# Altium project ProtoStack_H750VBT.PrjPcb
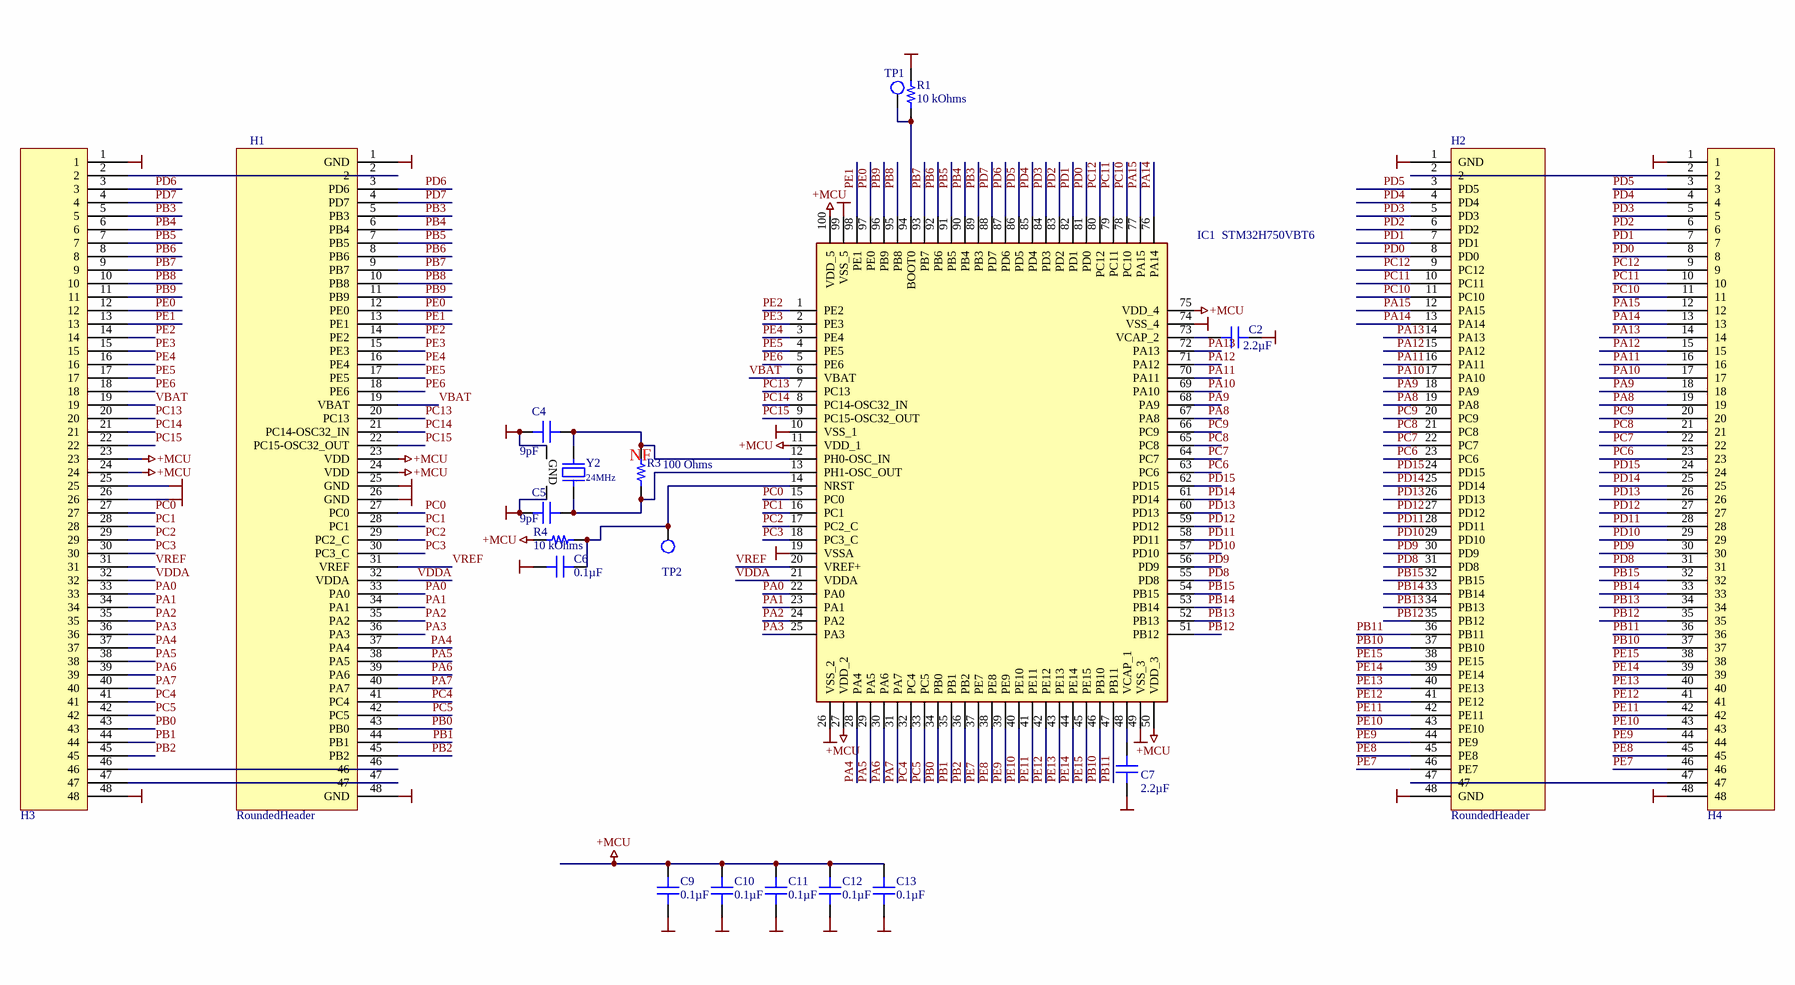
[diagram p0: ProtoStack_H750VBT.SchDoc]
1 sheet, 21 parts. Net scope: global (net labels, ports and power ports of the same name join across sheets).
Board file: ProtoStack_H750VBT.PcbDoc

## Sheet ProtoStack_H750VBT.SchDoc
size A2

### Parts
C2  2.2µF  [CAP 0805_2012]
C4  9pF  [CAP 0805_2012]
C5  9pF  [CAP 0805_2012]
C6  0.1µF  [CAP 0402_1005]
C7  2.2µF  [CAP 0805_2012]
C9  0.1µF  [CAP 0402_1005]
C10  0.1µF  [CAP 0402_1005]
C11  0.1µF  [CAP 0402_1005]
C12  0.1µF  [CAP 0402_1005]
C13  0.1µF  [CAP 0402_1005]
H1  RoundedHeader  [HeaderDtack_48]
H2  RoundedHeader  [HeaderDtack_48]
H3  male pin header  [Header_48]  (value not drawn)
H4  male pin header  [Header_48]  (value not drawn)
IC1  STM32H750VBT6  [QFP50P1600X1600X160-100N]
R1  10 kOhms  [RES 0603_1608]
R3  100 Ohms  [RES 0402_1005]
R4  10 kOhms  [RES 0603_1608]
TP1  TestPoint  [TESTPOINT_VIA]  (value not drawn)
TP2  NRST  [TESTPOINT]  (value not drawn)
Y2  24MHz  [NDK NX3225SA]

### Nets
+MCU: C9.1 C10.1 C11.1 C12.1 C13.1 H1.23(VDD) H1.24(VDD) H3.23 H3.24 IC1.11(VDD_1) IC1.27(VDD_2) IC1.50(VDD_3) IC1.75(VDD_4) IC1.100(VDD_5) R4.1
GND: C2.2 C4.1 C5.1 C6.1 C7.1 C9.2 C10.2 C11.2 C12.2 C13.2 H1.1(GND) H1.25(GND) H1.26(GND) H1.48(GND) H2.1(GND) H2.48(GND) H3.1 H3.25 H3.26 H3.48 H4.1 H4.48 IC1.10(VSS_1) IC1.19(VSSA) IC1.26(VSS_2) IC1.49(VSS_3) IC1.74(VSS_4) IC1.99(VSS_5) R1.2 Y2.2(GND) Y2.4(GND)
PA0: H1.33(PA0) H3.33 IC1.22(PA0)
PA1: H1.34(PA1) H3.34 IC1.23(PA1)
PA2: H1.35(PA2) H3.35 IC1.24(PA2)
PA3: H1.36(PA3) H3.36 IC1.25(PA3)
PA4: H1.37(PA4) H3.37 IC1.28(PA4)
PA5: H1.38(PA5) H3.38 IC1.29(PA5)
PA6: H1.39(PA6) H3.39 IC1.30(PA6)
PA7: H1.40(PA7) H3.40 IC1.31(PA7)
PA8: H2.19(PA8) H4.19 IC1.67(PA8)
PA9: H2.18(PA9) H4.18 IC1.68(PA9)
PA10: H2.17(PA10) H4.17 IC1.69(PA10)
PA11: H2.16(PA11) H4.16 IC1.70(PA11)
PA12: H2.15(PA12) H4.15 IC1.71(PA12)
PA13: H2.14(PA13) H4.14 IC1.72(PA13)
PA14: H2.13(PA14) H4.13 IC1.76(PA14)
PA15: H2.12(PA15) H4.12 IC1.77(PA15)
PB0: H1.43(PB0) H3.43 IC1.34(PB0)
PB1: H1.44(PB1) H3.44 IC1.35(PB1)
PB2: H1.45(PB2) H3.45 IC1.36(PB2)
PB3: H1.5(PB3) H3.5 IC1.89(PB3)
PB4: H1.6(PB4) H3.6 IC1.90(PB4)
PB5: H1.7(PB5) H3.7 IC1.91(PB5)
PB6: H1.8(PB6) H3.8 IC1.92(PB6)
PB7: H1.9(PB7) H3.9 IC1.93(PB7)
PB8: H1.10(PB8) H3.10 IC1.95(PB8)
PB9: H1.11(PB9) H3.11 IC1.96(PB9)
PB10: H2.37(PB10) H4.37 IC1.46(PB10)
PB11: H2.36(PB11) H4.36 IC1.47(PB11)
PB12: H2.35(PB12) H4.35 IC1.51(PB12)
PB13: H2.34(PB13) H4.34 IC1.52(PB13)
PB14: H2.33(PB14) H4.33 IC1.53(PB14)
PB15: H2.32(PB15) H4.32 IC1.54(PB15)
PC0: H1.27(PC0) H3.27 IC1.15(PC0)
PC1: H1.28(PC1) H3.28 IC1.16(PC1)
PC2: H1.29(PC2_C) H3.29 IC1.17(PC2_C)
PC3: H1.30(PC3_C) H3.30 IC1.18(PC3_C)
PC4: H1.41(PC4) H3.41 IC1.32(PC4)
PC5: H1.42(PC5) H3.42 IC1.33(PC5)
PC6: H2.23(PC6) H4.23 IC1.63(PC6)
PC7: H2.22(PC7) H4.22 IC1.64(PC7)
PC8: H2.21(PC8) H4.21 IC1.65(PC8)
PC9: H2.20(PC9) H4.20 IC1.66(PC9)
PC10: H2.11(PC10) H4.11 IC1.78(PC10)
PC11: H2.10(PC11) H4.10 IC1.79(PC11)
PC12: H2.9(PC12) H4.9 IC1.80(PC12)
PC13: H1.20(PC13) H3.20 IC1.7(PC13)
PC14: H1.21(PC14-OSC32_IN) H3.21 IC1.8(PC14-OSC32_IN)
PC15: H1.22(PC15-OSC32_OUT) H3.22 IC1.9(PC15-OSC32_OUT)
PD0: H2.8(PD0) H4.8 IC1.81(PD0)
PD1: H2.7(PD1) H4.7 IC1.82(PD1)
PD2: H2.6(PD2) H4.6 IC1.83(PD2)
PD3: H2.5(PD3) H4.5 IC1.84(PD3)
PD4: H2.4(PD4) H4.4 IC1.85(PD4)
PD5: H2.3(PD5) H4.3 IC1.86(PD5)
PD6: H1.3(PD6) H3.3 IC1.87(PD6)
PD7: H1.4(PD7) H3.4 IC1.88(PD7)
PD8: H2.31(PD8) H4.31 IC1.55(PD8)
PD9: H2.30(PD9) H4.30 IC1.56(PD9)
PD10: H2.29(PD10) H4.29 IC1.57(PD10)
PD11: H2.28(PD11) H4.28 IC1.58(PD11)
PD12: H2.27(PD12) H4.27 IC1.59(PD12)
PD13: H2.26(PD13) H4.26 IC1.60(PD13)
PD14: H2.25(PD14) H4.25 IC1.61(PD14)
PD15: H2.24(PD15) H4.24 IC1.62(PD15)
PE0: H1.12(PE0) H3.12 IC1.97(PE0)
PE1: H1.13(PE1) H3.13 IC1.98(PE1)
PE2: H1.14(PE2) H3.14 IC1.1(PE2)
PE3: H1.15(PE3) H3.15 IC1.2(PE3)
PE4: H1.16(PE4) H3.16 IC1.3(PE4)
PE5: H1.17(PE5) H3.17 IC1.4(PE5)
PE6: H1.18(PE6) H3.18 IC1.5(PE6)
PE7: H2.46(PE7) H4.46 IC1.37(PE7)
PE8: H2.45(PE8) H4.45 IC1.38(PE8)
PE9: H2.44(PE9) H4.44 IC1.39(PE9)
PE10: H2.43(PE10) H4.43 IC1.40(PE10)
PE11: H2.42(PE11) H4.42 IC1.41(PE11)
PE12: H2.41(PE12) H4.41 IC1.42(PE12)
PE13: H2.40(PE13) H4.40 IC1.43(PE13)
PE14: H2.39(PE14) H4.39 IC1.44(PE14)
PE15: H2.38(PE15) H4.38 IC1.45(PE15)
VBAT: H1.19(VBAT) H3.19 IC1.6(VBAT)
VDDA: H1.32(VDDA) H3.32 IC1.21(VDDA)
VREF: H1.31(VREF) H3.31 IC1.20(VREF+)
NetC2_1: C2.1 IC1.73(VCAP_2)
NetC4_2: C4.2 IC1.12(PH0-OSC_IN) R3.2 Y2.1
NetC5_2: C5.2 IC1.13(PH1-OSC_OUT) R3.1 Y2.3
NetC6_2: C6.2 IC1.14(NRST) R4.2 TP2.1
NetC7_2: C7.2 IC1.48(VCAP_1)
NetH1_2: H1.2 H3.2
NetH1_46: H1.46 H3.46
NetH1_47: H1.47 H3.47
NetH2_2: H2.2 H4.2
NetH2_47: H2.47 H4.47
NetIC1_94: IC1.94(BOOT0) R1.1 TP1.1

### Notes on the sheet
- (near R3) NF

### Library data of the parts
C2 C7 = C0805C225K8RACTU: CAP CER 2.2UF 10V X7R 0805; Manufacturer: KEMET; Tolerance: ±10%; Part Number: C0805C225K8RACTU; Value: 2.2µF; Applications: Bypass, Decoupling; Capacitance: 2.2µF; ComponentLink1Description: Datasheet; ComponentLink1URL: https://api.kemet.com/component-edge/download/datasheet/C0805C225K8RACTU.pdf; ComponentLink2Description: DigiKey Link; ComponentLink2URL: http://digikey.com/product-detail/en/kemet/C0805C225K8RACTU/399-3522-1-ND/789662; Device Package: 0805 (2012 Metric); LastUpdated: 9/2/2020 1:04:33 AM; Lifecycle Status: Active; Minimum Order: 1; Mounting Type: Surface Mount, MLCC; Operating Temperature: -55°C ~ 125°C; Package / Case: 0805 (2012 Metric); Packaging: TapeAndReel; PartId: 7297; Part Status: Active; Price: 0.04; Series: SMD Comm X7R; Size / Dimension: 0.079" L x 0.049" W (2.00mm x 1.25mm); Supplier 1: DigiKey; Supplier Part Number 1: 399-3522-1-ND; Temperature Coefficient: X7R; Thickness (Max): 0.055" (1.40mm); Voltage - Rated: 10V
C4 C5 = CBR08C909CAGAC: CAP CER 9PF 250V C0G/NP0 0805; Manufacturer: KEMET; Temperature Coefficient: C0G, NP0; Tolerance: ±0.25pF; Part Number: CBR08C909CAGAC; Value: 9pF; Applications: RF, Microwave, High Frequency; Capacitance: 9pF; ComponentLink1Description: Datasheet; ComponentLink1URL: https://api.kemet.com/component-edge/download/datasheet/CBR08C909CAGAC.pdf; ComponentLink2Description: DigiKey Link; ComponentLink2URL: http://digikey.com/product-detail/en/kemet/CBR08C909CAGAC/399-8711-1-ND/3480335; Device Package: 0805 (2012 Metric); Features: High Q, Low Loss, Ultra Low ESR; LastUpdated: 9/2/2020 1:04:31 AM; Lifecycle Status: Active; Minimum Order: 1; Mounting Type: Surface Mount, MLCC; Operating Temperature: -55°C ~ 125°C; Package / Case: 0805 (2012 Metric); Packaging: TapeAndReel; PartId: 8592; Part Status: Active; Price: 0.28; Series: CBR-SMD RF C0G; Size / Dimension: 0.079" L x 0.049" W (2.00mm x 1.25mm); Supplier 1: DigiKey; Supplier Part Number 1: 399-8711-1-ND; Thickness (Max): 0.035" (0.88mm); Voltage - Rated: 250V
C6 C9-C13 = C0402C104K4RACAUTO: CAP CER 0.1UF 16V X7R 0402; Manufacturer: KEMET; Tolerance: ±10%; Part Number: C0402C104K4RACAUTO; Value: 0.1µF; Applications: Automotive, Bypass, Decoupling; Capacitance: 0.1µF; ComponentLink1Description: Datasheet; ComponentLink1URL: https://api.kemet.com/component-edge/download/specsheet/C0402C104K4RACAUTO.pdf; ComponentLink2Description: DigiKey Link; ComponentLink2URL: http://digikey.com/product-detail/en/kemet/C0402C104K4RACAUTO/399-6828-1-ND/3314343; Device Package: 0402 (1005 Metric); LastUpdated: 9/2/2020 1:02:21 AM; Lifecycle Status: Active; Minimum Order: 1; Mounting Type: Surface Mount, MLCC; Operating Temperature: -55°C ~ 125°C; Package / Case: 0402 (1005 Metric); Packaging: TapeAndReel; PartId: 3024; Part Status: Active; Price: 0.01; Ratings: AEC-Q200; Series: SMD Auto X7R; Size / Dimension: 0.039" L x 0.020" W (1.00mm x 0.50mm); Supplier 1: DigiKey; Supplier Part Number 1: 399-6828-1-ND; Temperature Coefficient: X7R; Thickness (Max): 0.022" (0.55mm); Voltage - Rated: 16V
H1 = HeaderStack_48_H7VB50_L
H2 = HeaderStack_48_H7VB50_R
H3 H4 = Header_48
IC1 = STM32H750VBT6: Integrated Circuit; Manufacturer_Name: STMicroelectronics; Datasheet Link: https://www.st.com/resource/en/datasheet/stm32h750vb.pdf; Height: 1.6mm; Manufacturer_Part_Number: STM32H750VBT6; Mouser Part Number: 511-STM32H750VBT6; Mouser Price/Stock: https://www.mouser.co.uk/ProductDetail/STMicroelectronics/STM32H750VBT6?qs=%252BEew9%252B0nqrBAeuu%2FsQQSzQ%3D%3D; Arrow Part Number: STM32H750VBT6; Arrow Price/Stock: https://www.arrow.com/en/products/stm32h750vbt6/stmicroelectronics?region=nac
R1 R4 = RT0603FRE0710KL: RES SMD 10K OHM 1% 1/10W 0603; Manufacturer: Yageo; Power (Watts): 0.1W, 1/10W; Temperature Coefficient: ±50ppm/°C; Part Number: RT0603FRE0710KL; Value: 10 kOhms; ComponentLink1Description: Datasheet; ComponentLink1URL: https://www.yageo.com/upload/media/product/productsearch/datasheet/rchip/PYu-RT_1-to-0.01_RoHS_L_11.pdf; ComponentLink2Description: DigiKey Link; ComponentLink2URL: http://digikey.com/product-detail/en/yageo/RT0603FRE0710KL/YAG2321CT-ND/5252435; Composition: Thin Film; Device Package: 0603 (1608 Metric); Height - Seated (Max): 0.022" (0.55mm); LastUpdated: 9/2/2020 1:10:23 AM; Lifecycle Status: Active; Minimum Order: 1; Number of Terminations: 2; Operating Temperature: -55°C ~ 155°C; Package / Case: 0603 (1608 Metric); Packaging: TapeAndReel; PartId: 5671; Part Status: Active; Price: 0.01; Resistance: 10 kOhms; Series: RT; Size / Dimension: 0.063" L x 0.031" W (1.60mm x 0.80mm); Supplier 1: DigiKey; Supplier Part Number 1: YAG2321CT-ND; Supplier Device Package: 0603; Tolerance: ±1%
R3 = RT0402FRE07100RL: RES SMD 100 OHM 1% 1/16W 0402; Manufacturer: Yageo; Power (Watts): 0.063W, 1/16W; Temperature Coefficient: ±50ppm/°C; Not Fit: NF; Part Number: RT0402FRE07100RL; Value: 100 Ohms; ComponentLink1Description: Datasheet; ComponentLink1URL: https://www.yageo.com/upload/media/product/productsearch/datasheet/rchip/PYu-RT_1-to-0.01_RoHS_L_11.pdf; ComponentLink2Description: DigiKey Link; ComponentLink2URL: http://digikey.com/product-detail/en/yageo/RT0402FRE07100RL/YAG3342CT-ND/5418047; Composition: Thin Film; Device Package: 0402 (1005 Metric); Height - Seated (Max): 0.014" (0.35mm); LastUpdated: 9/2/2020 1:08:09 AM; Lifecycle Status: Active; Minimum Order: 1; Number of Terminations: 2; Operating Temperature: -55°C ~ 155°C; Package / Case: 0402 (1005 Metric); Packaging: TapeAndReel; PartId: 3193; Part Status: Active; Price: 0.01; Resistance: 100 Ohms; Series: RT; Size / Dimension: 0.039" L x 0.020" W (1.00mm x 0.50mm); Supplier 1: DigiKey; Supplier Part Number 1: YAG3342CT-ND; Supplier Device Package: 0402; Tolerance: ±1%
TP2 = TestPoint
Y2 = NX3225SA-24MHZ-EXS00A-CS07532: CRYSTAL 24MHZ 9PF SMD; Manufacturer: NDK America, Inc.; ESR (Equivalent Series Resistance): 100 Ohms; Operating Mode: Fundamental; Part Number: NX3225SA-24MHZ-EXS00A-CS07532; ComponentLink2Description: DigiKey Link; ComponentLink2URL: http://digikey.com/product-detail/en/ndk-america-inc/NX3225SA-24MHZ-EXS00A-CS07532/644-1393-1-ND/9172121; Frequency: 24MHz; Height - Seated (Max): 0.024" (0.60mm); LastUpdated: 9/2/2020 1:21:59 AM; Lifecycle Status: Active; Load Capacitance: 9pF; Minimum Order: 1; Mounting Type: Surface Mount; Operating Temperature: -40°C ~ 150°C; Package / Case: 4-SMD, No Lead; Packaging: TapeAndReel; PartId: 571; Part Status: Active; Price: 0.38; Ratings: AEC-Q200; Series: NX3225SA; Size / Dimension: 0.126" L x 0.098" W (3.20mm x 2.50mm); Supplier 1: DigiKey; Supplier Part Number 1: 644-1393-1-ND; Type: MHz Crystal; Value: 24MHz